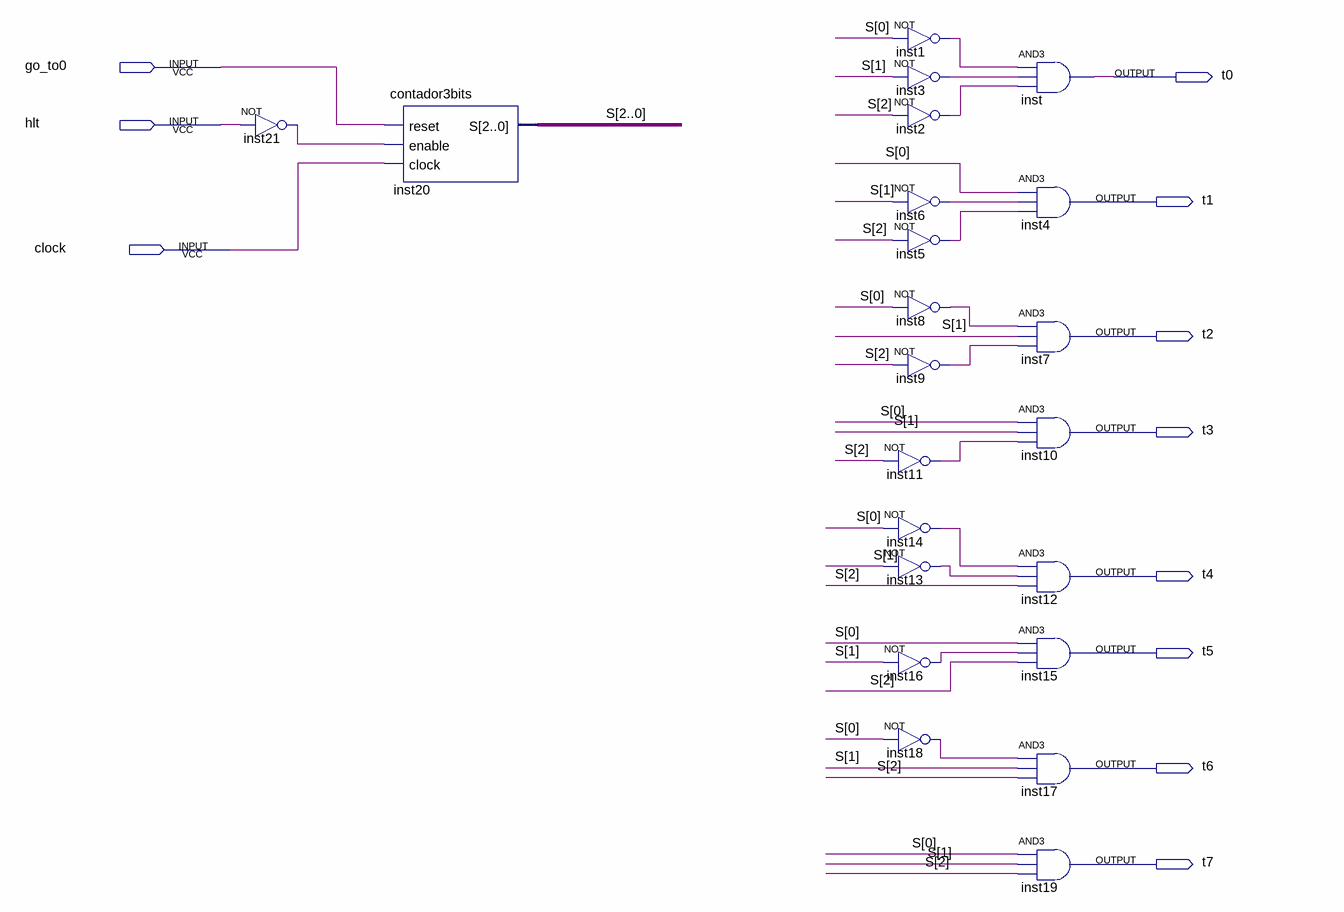
[diagram p0: schematic sheet]
// Quartus schematic temporizador.bdf as structural Verilog: 22 symbols, 11 pins
module temporizador (
  input  go_to0,
  input  hlt,
  input  clock,
  output t0,
  output t1,
  output t2,
  output t3,
  output t4,
  output t5,
  output t6,
  output t7
);

  wire inst1_out, inst2_out, inst3_out, inst5_out, inst6_out, inst8_out, inst9_out, inst11_out, inst13_out,
       inst14_out, inst16_out, inst18_out, inst21_out;
  wire [2:0] S;

  not inst21 (inst21_out, hlt);
  contador3bits inst20 (.reset(go_to0), .enable(inst21_out), .clock(clock), .S(S));
  not inst1 (inst1_out, S[0]);
  not inst3 (inst3_out, S[1]);
  not inst2 (inst2_out, S[2]);
  not inst6 (inst6_out, S[1]);
  not inst5 (inst5_out, S[2]);
  not inst8 (inst8_out, S[0]);
  not inst9 (inst9_out, S[2]);
  not inst11 (inst11_out, S[2]);
  not inst14 (inst14_out, S[0]);
  not inst13 (inst13_out, S[1]);
  not inst16 (inst16_out, S[1]);
  not inst18 (inst18_out, S[0]);
  and inst (t0, inst1_out, inst3_out, inst2_out);
  and inst4 (t1, S[0], inst6_out, inst5_out);
  and inst7 (t2, inst8_out, S[1], inst9_out);
  and inst10 (t3, S[0], S[1], inst11_out);
  and inst12 (t4, inst14_out, inst13_out, S[2]);
  and inst15 (t5, S[0], inst16_out, S[2]);
  and inst17 (t6, inst18_out, S[1], S[2]);
  and inst19 (t7, S[0], S[1], S[2]);
endmodule
